# Altium schematic sheet config-ground.SchDoc: Config FPGA - Ground
size Letter; CompanyName: Brinton Engineering, LLC; Address1: 3479 Edison Way; Address2: Menlo Park CA 94025; Address3: +1 (877) 778-8435; Address4: brintonengineering.com; Revision: 1; SheetNumber: 1; SheetTotal: 1
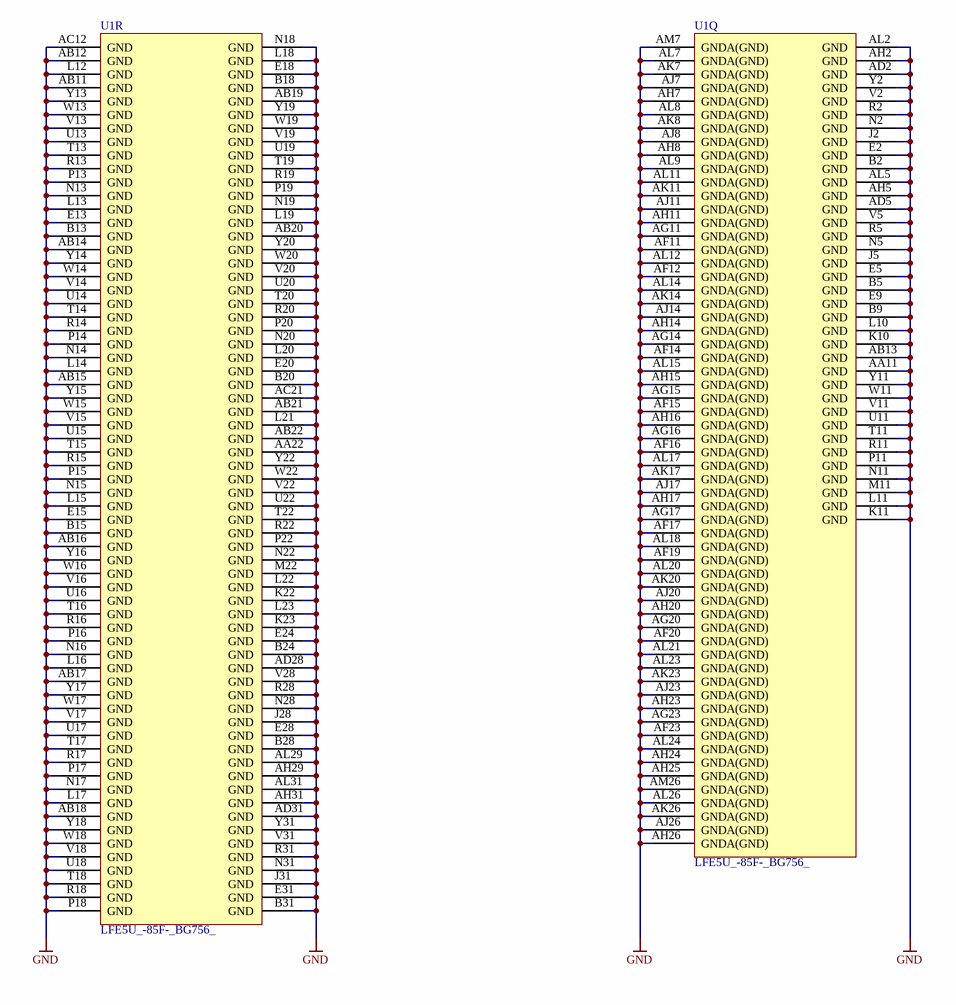
[diagram p0: config-ground.SchDoc]

## Parts
U1  LFE5U_-85F-_BG756_  [caBGA756]  (parts Q,R of 19)

## Nets
GND: U1.AA11(GND) U1.AA22(GND) U1.AB11(GND) U1.AB12(GND) U1.AB13(GND) U1.AB14(GND) U1.AB15(GND) U1.AB16(GND) U1.AB17(GND) U1.AB18(GND) U1.AB19(GND) U1.AB20(GND) U1.AB21(GND) U1.AB22(GND) U1.AC12(GND) U1.AC21(GND) U1.AD2(GND) U1.AD5(GND) U1.AD28(GND) U1.AD31(GND) U1.AF11(GNDA(GND)) U1.AF12(GNDA(GND)) U1.AF14(GNDA(GND)) U1.AF15(GNDA(GND)) U1.AF16(GNDA(GND)) U1.AF17(GNDA(GND)) U1.AF19(GNDA(GND)) U1.AF20(GNDA(GND)) U1.AF23(GNDA(GND)) U1.AG11(GNDA(GND)) U1.AG14(GNDA(GND)) U1.AG15(GNDA(GND)) U1.AG16(GNDA(GND)) U1.AG17(GNDA(GND)) U1.AG20(GNDA(GND)) U1.AG23(GNDA(GND)) U1.AH2(GND) U1.AH5(GND) U1.AH7(GNDA(GND)) U1.AH8(GNDA(GND)) U1.AH11(GNDA(GND)) U1.AH14(GNDA(GND)) U1.AH15(GNDA(GND)) U1.AH16(GNDA(GND)) U1.AH17(GNDA(GND)) U1.AH20(GNDA(GND)) U1.AH23(GNDA(GND)) U1.AH24(GNDA(GND)) U1.AH25(GNDA(GND)) U1.AH26(GNDA(GND)) U1.AH29(GND) U1.AH31(GND) U1.AJ7(GNDA(GND)) U1.AJ8(GNDA(GND)) U1.AJ11(GNDA(GND)) U1.AJ14(GNDA(GND)) U1.AJ17(GNDA(GND)) U1.AJ20(GNDA(GND)) U1.AJ23(GNDA(GND)) U1.AJ26(GNDA(GND)) U1.AK7(GNDA(GND)) U1.AK8(GNDA(GND)) U1.AK11(GNDA(GND)) U1.AK14(GNDA(GND)) U1.AK17(GNDA(GND)) U1.AK20(GNDA(GND)) U1.AK23(GNDA(GND)) U1.AK26(GNDA(GND)) U1.AL2(GND) U1.AL5(GND) U1.AL7(GNDA(GND)) U1.AL8(GNDA(GND)) U1.AL9(GNDA(GND)) U1.AL11(GNDA(GND)) U1.AL12(GNDA(GND)) U1.AL14(GNDA(GND)) U1.AL15(GNDA(GND)) U1.AL17(GNDA(GND)) U1.AL18(GNDA(GND)) U1.AL20(GNDA(GND)) U1.AL21(GNDA(GND)) U1.AL23(GNDA(GND)) U1.AL24(GNDA(GND)) U1.AL26(GNDA(GND)) U1.AL29(GND) U1.AL31(GND) U1.AM7(GNDA(GND)) U1.AM26(GNDA(GND)) U1.B2(GND) U1.B5(GND) U1.B9(GND) U1.B13(GND) U1.B15(GND) U1.B18(GND) U1.B20(GND) U1.B24(GND) U1.B28(GND) U1.B31(GND) U1.E2(GND) U1.E5(GND) U1.E9(GND) U1.E13(GND) U1.E15(GND) U1.E18(GND) U1.E20(GND) U1.E24(GND) U1.E28(GND) U1.E31(GND) U1.J2(GND) U1.J5(GND) U1.J28(GND) U1.J31(GND) U1.K10(GND) U1.K11(GND) U1.K22(GND) U1.K23(GND) U1.L10(GND) U1.L11(GND) U1.L12(GND) U1.L13(GND) U1.L14(GND) U1.L15(GND) U1.L16(GND) U1.L17(GND) U1.L18(GND) U1.L19(GND) U1.L20(GND) U1.L21(GND) U1.L22(GND) U1.L23(GND) U1.M11(GND) U1.M22(GND) U1.N2(GND) U1.N5(GND) U1.N11(GND) U1.N13(GND) U1.N14(GND) U1.N15(GND) U1.N16(GND) U1.N17(GND) U1.N18(GND) U1.N19(GND) U1.N20(GND) U1.N22(GND) U1.N28(GND) U1.N31(GND) U1.P11(GND) U1.P13(GND) U1.P14(GND) U1.P15(GND) U1.P16(GND) U1.P17(GND) U1.P18(GND) U1.P19(GND) U1.P20(GND) U1.P22(GND) U1.R2(GND) U1.R5(GND) U1.R11(GND) U1.R13(GND) U1.R14(GND) U1.R15(GND) U1.R16(GND) U1.R17(GND) U1.R18(GND) U1.R19(GND) U1.R20(GND) U1.R22(GND) U1.R28(GND) U1.R31(GND) U1.T11(GND) U1.T13(GND) U1.T14(GND) U1.T15(GND) U1.T16(GND) U1.T17(GND) U1.T18(GND) U1.T19(GND) U1.T20(GND) U1.T22(GND) U1.U11(GND) U1.U13(GND) U1.U14(GND) U1.U15(GND) U1.U16(GND) U1.U17(GND) U1.U18(GND) U1.U19(GND) U1.U20(GND) U1.U22(GND) U1.V2(GND) U1.V5(GND) U1.V11(GND) U1.V13(GND) U1.V14(GND) U1.V15(GND) U1.V16(GND) U1.V17(GND) U1.V18(GND) U1.V19(GND) U1.V20(GND) U1.V22(GND) U1.V28(GND) U1.V31(GND) U1.W11(GND) U1.W13(GND) U1.W14(GND) U1.W15(GND) U1.W16(GND) U1.W17(GND) U1.W18(GND) U1.W19(GND) U1.W20(GND) U1.W22(GND) U1.Y2(GND) U1.Y11(GND) U1.Y13(GND) U1.Y14(GND) U1.Y15(GND) U1.Y16(GND) U1.Y17(GND) U1.Y18(GND) U1.Y19(GND) U1.Y20(GND) U1.Y22(GND) U1.Y31(GND)

## Notes on the sheet
- Title
- Engineer
- Revision
- Drawn By
- Checked By
- Date
- Sheet
- of

## Library data of the parts
U1 = LFE5U_-85F-_BG756_: ECP5 FPGA, 85k LUT, 756-caBGA; Manufacturer: Lattice Semiconductor; Manufacturer P/N: LFE5U_-85F-_BG756_